# EAGLE design base (EAGLE 9.2.2)
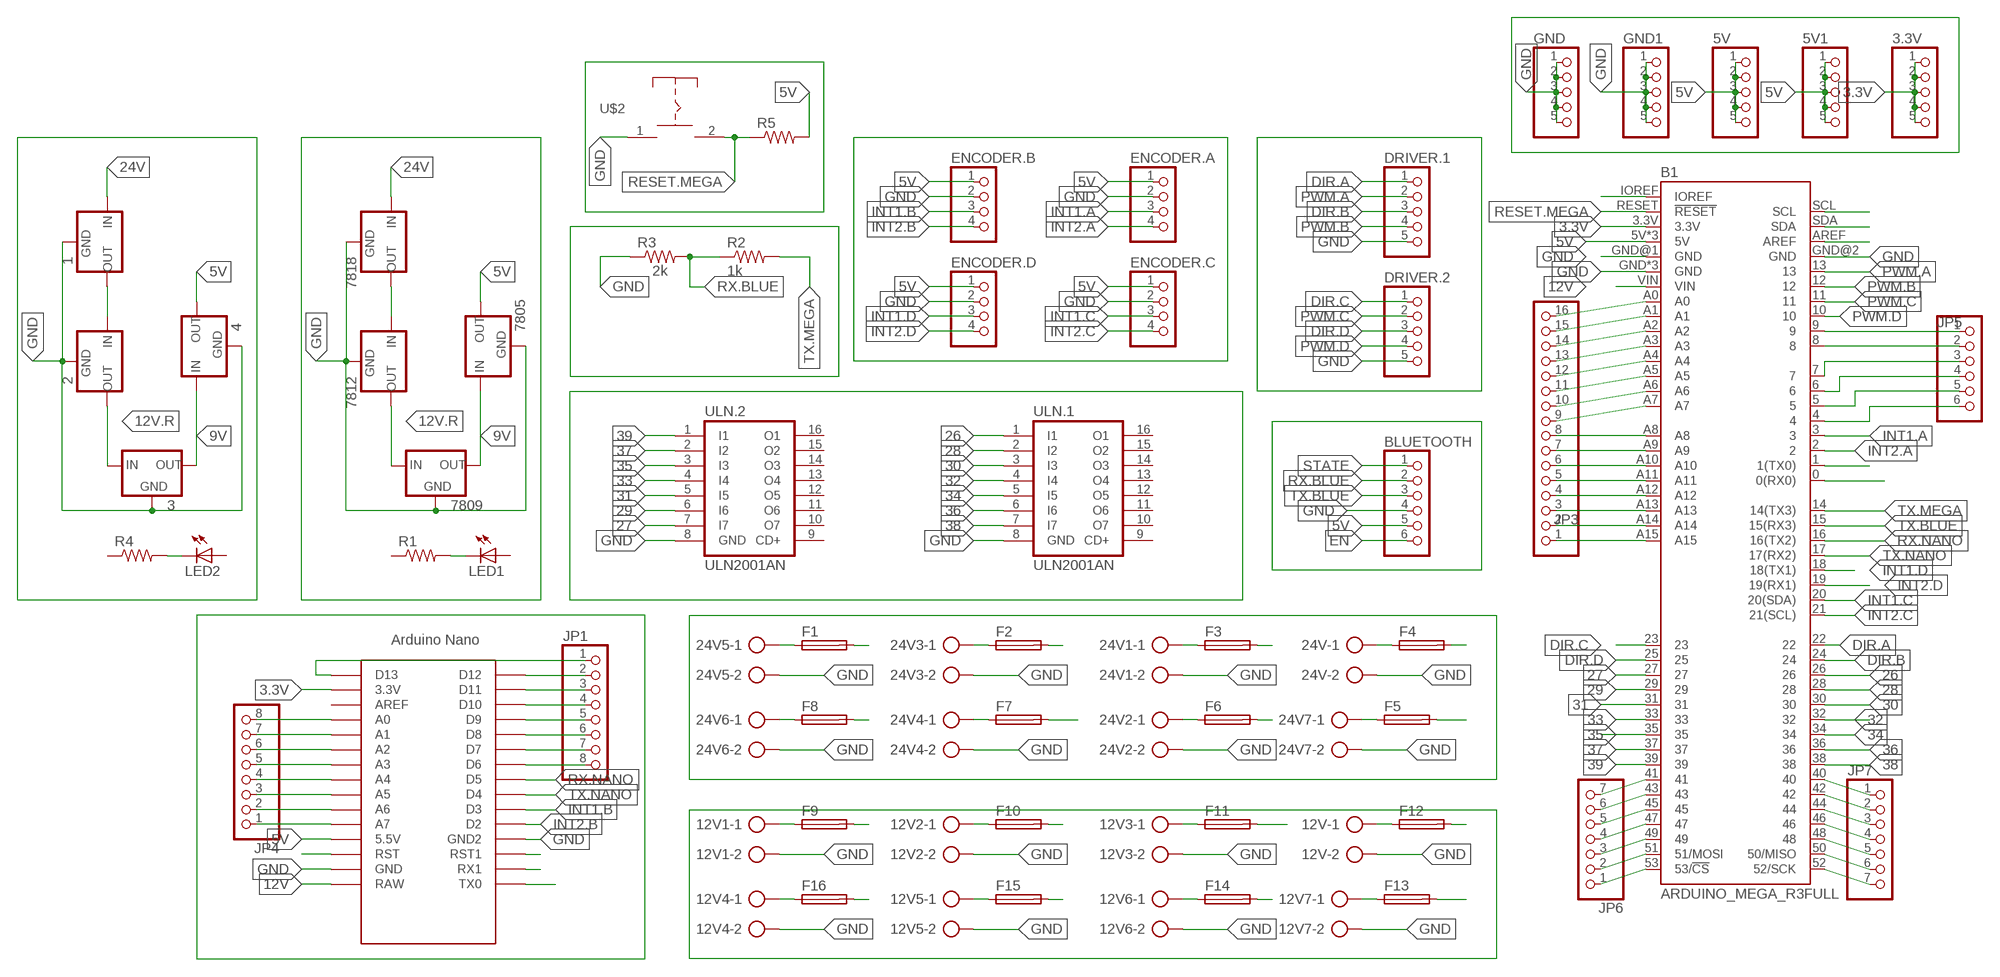
[diagram p0: schematic, sheet 1]

## Parts
1  78XXS  [78XXS]
2  78XXS  [78XXS]
3  78XXS  [78XXS]
3.3V  PINHD-1X5  [1X05]
4  78XXS  [78XXS]
5V  PINHD-1X5  [1X05]
5V1  PINHD-1X5  [1X05]
12V  AK300/2  [AK300/2]
12V1  AK300/2  [AK300/2]
12V2  AK300/2  [AK300/2]
12V3  AK300/2  [AK300/2]
12V4  AK300/2  [AK300/2]
12V5  AK300/2  [AK300/2]
12V6  AK300/2  [AK300/2]
12V7  AK300/2  [AK300/2]
24V  AK300/2  [AK300/2]
24V1  AK300/2  [AK300/2]
24V2  AK300/2  [AK300/2]
24V3  AK300/2  [AK300/2]
24V4  AK300/2  [AK300/2]
24V5  AK300/2  [AK300/2]
24V6  AK300/2  [AK300/2]
24V7  AK300/2  [AK300/2]
7805  78XXS  [78XXS]
7809  78XXS  [78XXS]
7812  78XXS  [78XXS]
7818  78XXS  [78XXS]
B1  ARDUINO_MEGA_R3FULL  [ARDUINO_MEGA_NO_SILK]
BLUETOOTH  PINHD-1X6  [1X06]
DRIVER.1  PINHD-1X5  [1X05]
DRIVER.2  PINHD-1X5  [1X05]
ENCODER.A  PINHD-1X4  [1X04]
ENCODER.B  PINHD-1X4  [1X04]
ENCODER.C  PINHD-1X4  [1X04]
ENCODER.D  PINHD-1X4  [1X04]
F1  GSH15  [GSH15]
F2  GSH15  [GSH15]
F3  GSH15  [GSH15]
F4  GSH15  [GSH15]
F5  GSH15  [GSH15]
F6  GSH15  [GSH15]
F7  GSH15  [GSH15]
F8  GSH15  [GSH15]
F9  GSH15  [GSH15]
F10  GSH15  [GSH15]
F11  GSH15  [GSH15]
F12  GSH15  [GSH15]
F13  GSH15  [GSH15]
F14  GSH15  [GSH15]
F15  GSH15  [GSH15]
F16  GSH15  [GSH15]
GND  PINHD-1X5  [1X05]
GND1  PINHD-1X5  [1X05]
JP1  PINHD-1X8  [1X08]
JP3  PINHD-1X16  [1X16]
JP4  PINHD-1X8  [1X08]
JP5  PINHD-1X6  [1X06]
JP6  PINHD-1X7  [1X07]
JP7  PINHD-1X7  [1X07]
LED1  LED5MM  [LED5MM]
LED2  LED5MM  [LED5MM]
R1  R-US_0204/7  [0204/7]
R2  1k  R-US_0204/7  [0204/7]
R3  2k  R-US_0207/10  [0207/10]
R4  R-US_0204/7  [0204/7]
R5  R-US_0204/7  [0204/7]
U$1  NANO  [NANO]
U$2  PUSHBOTTON  [PUSHBOTTON]
ULN.1  ULN2001AN  [DIL16]
ULN.2  ULN2001AN  [DIL16]

## Nets
3.3V: 3.3V.1 3.3V.2 3.3V.3 3.3V.4 3.3V.5 B1.3.3V U$1.3.3V
5V: 4.OUT 5V1.1 5V1.2 5V1.3 5V1.4 5V1.5 5V.1 5V.2 5V.3 5V.4 5V.5 7805.OUT B1.5V B1.5V@1(5V) B1.5V@2(5V) BLUETOOTH.5 ENCODER.A.1 ENCODER.B.1 ENCODER.C.1 ENCODER.D.1 R5.2 U$1.5V(5.5V)
9V: 3.OUT 4.IN 7805.IN 7809.OUT
12V: B1.VIN U$1.RAW
12V.R: 2.OUT 3.IN 7809.IN 7812.OUT
24V: 1.IN 7818.IN
26: B1.26 ULN.1.1(I1)
27: B1.27 ULN.2.7(I7)
28: B1.28 ULN.1.2(I2)
29: B1.29 ULN.2.6(I6)
30: B1.30 ULN.1.3(I3)
31: B1.31 ULN.2.5(I5)
32: B1.32 ULN.1.4(I4)
33: B1.33 ULN.2.4(I4)
34: B1.34 ULN.1.5(I5)
35: B1.35 ULN.2.3(I3)
36: B1.36 ULN.1.6(I6)
37: B1.37 ULN.2.2(I2)
38: B1.38 ULN.1.7(I7)
39: B1.39 ULN.2.1(I1)
40: B1.40 JP7.1
DIR.A: B1.22 DRIVER.1.1
DIR.B: B1.24 DRIVER.1.3
DIR.C: B1.23 DRIVER.2.1
DIR.D: B1.25 DRIVER.2.3
EN: BLUETOOTH.6
GND: 1.GND 2.GND 3.GND 4.GND 12V1.2 12V2.2 12V3.2 12V4.2 12V5.2 12V6.2 12V7.2 12V.2 24V1.2 24V2.2 24V3.2 24V4.2 24V5.2 24V6.2 24V7.2 24V.2 7805.GND 7809.GND 7812.GND 7818.GND B1.GND B1.GND@1(GND) B1.GND@2(GND) B1.GND@3(GND) B1.GND@4(GND) BLUETOOTH.4 DRIVER.1.5 DRIVER.2.5 ENCODER.A.2 ENCODER.B.2 ENCODER.C.2 ENCODER.D.2 GND1.1 GND1.2 GND1.3 GND1.4 GND1.5 GND.1 GND.2 GND.3 GND.4 GND.5 R3.1 U$1.GND U$1.GND1(GND2) U$2.1 ULN.1.8(GND) ULN.2.8(GND)
INT1.A: B1.3 ENCODER.A.3
INT1.B: ENCODER.B.3 U$1.D3
INT1.C: B1.20(20(SDA)) ENCODER.C.3
INT1.D: B1.18(18(TX1)) ENCODER.D.3
INT2.A: B1.2 ENCODER.A.4
INT2.B: ENCODER.B.4 U$1.D2
INT2.C: B1.21(21(SCL)) ENCODER.C.4
INT2.D: B1.19(19(RX1)) ENCODER.D.4
N$1: B1.SCL
N$2: B1.SDA
N$3: B1.AREF
N$6: 7812.IN 7818.OUT
N$8: LED2.K(C) R4.2
N$9: B1.9 JP5.1
N$10: B1.8 JP5.2
N$11: B1.7 JP5.3
N$12: B1.6 JP5.4
N$13: B1.5 JP5.5
N$14: B1.4 JP5.6
N$15: 1.OUT 2.IN
N$17: B1.1(1(TX0))
N$18: B1.0(0(RX0))
N$37: B1.42 JP7.2
N$38: B1.44 JP7.3
N$39: B1.46 JP7.4
N$40: B1.48 JP7.5
N$41: B1.50(50/MISO) JP7.6
N$42: B1.52(52/SCK) JP7.7
N$43: B1.IOREF
N$50: B1.A0 JP3.16
N$51: B1.A1 JP3.15
N$52: B1.A2 JP3.14
N$53: B1.A3 JP3.13
N$54: B1.A4 JP3.12
N$55: B1.A5 JP3.11
N$56: B1.A6 JP3.10
N$57: B1.A7 JP3.9
N$58: B1.A8 JP3.8
N$59: B1.A9 JP3.7
N$60: B1.A10 JP3.6
N$61: B1.A11 JP3.5
N$62: B1.A12 JP3.4
N$63: B1.A13 JP3.3
N$64: B1.A14 JP3.2
N$65: B1.A15 JP3.1
N$75: B1.41 JP6.7
N$76: B1.45 JP6.5
N$77: B1.43 JP6.6
N$78: B1.47 JP6.4
N$79: B1.49 JP6.3
N$80: B1.51(51/MOSI) JP6.2
N$81: B1.53(53/!CS) JP6.1
N$106: LED1.K(C) R1.2
N$107: JP1.1 U$1.D13
N$110: JP4.8 U$1.A0
N$111: JP4.7 U$1.A1
N$112: JP4.6 U$1.A2
N$113: JP4.5 U$1.A3
N$114: JP4.4 U$1.A4
N$115: JP4.3 U$1.A5
N$116: JP4.2 U$1.A6
N$117: JP4.1 U$1.A7
N$119: U$1.RST
N$122: JP1.2 U$1.D12
N$123: JP1.3 U$1.D11
N$124: JP1.4 U$1.D10
N$125: JP1.5 U$1.D9
N$126: JP1.6 U$1.D8
N$127: JP1.7 U$1.D7
N$128: JP1.8 U$1.D6
N$134: U$1.RST1
N$135: U$1.RX1
N$136: U$1.TX0
N$137: 12V7.1 F13.1
N$138: 24V5.1 F1.1
N$139: 24V6.1 F8.1
N$140: 24V3.1 F2.1
N$141: 24V4.1 F7.1
N$142: 24V1.1 F3.1
N$143: 24V.1 F4.1
N$144: 24V7.1 F5.1
N$145: 24V2.1 F6.1
N$146: 12V2.1 F10.1
N$147: 12V3.1 F11.1
N$148: 12V.1 F12.1
N$149: 12V6.1 F14.1
N$150: 12V5.1 F15.1
N$151: 12V4.1 F16.1
N$152: 12V1.1 F9.1
N$153: F1.2
N$154: F2.2
N$155: F3.2
N$156: F4.2
N$157: F5.2
N$158: F6.2
N$159: F7.2
N$160: F8.2
N$161: F9.2
N$162: F16.2
N$163: F15.2
N$164: F10.2
N$165: F11.2
N$166: F14.2
N$167: F13.2
N$168: F12.2
PWM.A: B1.13 DRIVER.1.2
PWM.B: B1.12 DRIVER.1.4
PWM.C: B1.11 DRIVER.2.2
PWM.D: B1.10 DRIVER.2.4
RESET.MEGA: B1.RESET(!RESET) R5.1 U$2.2
RX.BLUE: BLUETOOTH.2 R2.1 R3.2
RX.NANO: B1.16(16(TX2)) U$1.D5
STATE: BLUETOOTH.1
TX.BLUE: B1.15(15(RX3)) BLUETOOTH.3
TX.MEGA: B1.14(14(TX3)) R2.2
TX.NANO: B1.17(17(RX2)) U$1.D4
Unconnected: LED1.A LED2.A R1.1 R4.1 U$1.AREF ULN.1.9(CD+) ULN.1.10(O7) ULN.1.11(O6) ULN.1.12(O5) ULN.1.13(O4) ULN.1.14(O3) ULN.1.15(O2) ULN.1.16(O1) ULN.2.9(CD+) ULN.2.10(O7) ULN.2.11(O6) ULN.2.12(O5) ULN.2.13(O4) ULN.2.14(O3) ULN.2.15(O2) ULN.2.16(O1)

## Library data of the parts
1-4 7805 7809 7812 7818 = v-reg:78XXS: VOLTAGE REGULATOR
3.3V 5V 5V1 DRIVER.1 DRIVER.2 GND GND1 = pinhead:PINHD-1X5: PIN HEADER
12V 12V1-12V7 24V 24V1-24V7 = con-ptr500:AK300/2: CONNECTOR; OC_FARNELL: unknown; OC_NEWARK: unknown
B1 = SparkFun-Boards:ARDUINO_MEGA_R3: Arduino Mega R3 ATmega2560 R3 compatible footprint. SparkFun Products: Arduino Mega 2560 R3 <https://www.sparkfun.com/products/11061>
BLUETOOTH JP5 = pinhead:PINHD-1X6: PIN HEADER
ENCODER.A ENCODER.B ENCODER.C ENCODER.D = pinhead:PINHD-1X4: PIN HEADER
F1-F16 = fuse:GSH15: FUSE HOLDER grid 15mm, 19649 Wickmann; MPN: 64900001039; OC_FARNELL: 1271673; OC_NEWARK: 02P0318
JP1 JP4 = pinhead:PINHD-1X8: PIN HEADER
JP3 = pinhead:PINHD-1X16: PIN HEADER
JP6 JP7 = pinhead:PINHD-1X7: PIN HEADER
LED1 LED2 = led:LED: LED OSRAM: - CHIPLED LG R971, LG N971, LY N971, LG Q971, LY Q971, LO R971, LY R971 LH N974, LH R974 LS Q976, LO Q976, LY Q976 LO Q996 - Hyper CHIPLED LW Q18S LB Q993, LB Q99A, LB R99A - SideLED LS A670, LO A670, LY A670, LG A670, LP A670 LB A673, LV A673, LT A673, LW A673 LH A674 LY A675 LS A676, LA A676, LO A676, LY A676, LW A676 LS A679, LY A679, LG A679 - Hyper Micro SIDELED® LS Y876, LA Y876, LO Y876, LY Y876 LT Y87S - SmartLED LW L88C, LW L88S LB L89C, LB L89S, LG L890 LS L89K, LO L89K, LY L89K LS L896, LA L896, LO L896, LY L896 - TOPLED LS T670, LO T670, LY T670, LG T670, LP T670 LSG T670, LSP T670, LSY T670, LOP T670, LYG T670 LG T671, LOG T671, LSG T671 LB T673, LV T673, LT T673, LW T673 LH T674 LS T676, LA T676, LO T676, LY T676, LB T676, LH T676, LSB T676, LW T676 LB T67C, LV T67C, LT T67C, LS T67K, LO T67K, LY T67K, LW E67C LS E67B, LA E67B, LO E67B, LY E67B, LB E67C, LV E67C, LT E67C LW T67C LS T679, LY T679, LG T679 LS T770, LO T770, LY T770, LG T770, LP T770 LB T773, LV T773, LT T773, LW T773 LH T774 LS E675, LA E675, LY E675, LS T675 LS T776, LA T776, LO T776, LY T776, LB T776 LHGB T686 LT T68C, LB T68C - Hyper Mini TOPLED® LB M676 - Mini TOPLED Santana® LG M470 LS M47K, LO M47K, LY M47K Source: http://www.osram.convergy.de LUXEON: - LUMILED® LXK2-PW12-R00, LXK2-PW12-S00, LXK2-PW14-U00, LXK2-PW14-V00 LXK2-PM12-R00, LXK2-PM12-S00, LXK2-PM14-U00 LXK2-PE12-Q00, LXK2-PE12-R00, LXK2-PE12-S00, LXK2-PE14-T00, LXK2-PE14-U00 LXK2-PB12-K00, LXK2-PB12-L00, LXK2-PB12-M00, LXK2-PB14-N00, LXK2-PB14-P00, LXK2-PB14-Q00 LXK2-PR12-L00, LXK2-PR12-M00, LXK2-PR14-Q00, LXK2-PR14-R00 LXK2-PD12-Q00, LXK2-PD12-R00, LXK2-PD12-S00 LXK2-PH12-R00, LXK2-PH12-S00 LXK2-PL12-P00, LXK2-PL12-Q00, LXK2-PL12-R00 Source: www.luxeon.com KINGBRIGHT: KA-3528ASYC Source: www.kingbright.com
R1-R5 = rcl:R-US_: RESISTOR, American symbol; SPICEPREFIX: R
U$1 = Arduino-clone:NANO: Arduino Nano
U$2 = push botton:PUSHBOTTON
ULN.1 ULN.2 = uln-udn:ULN2001A: DRIVER ARRAY

## Board
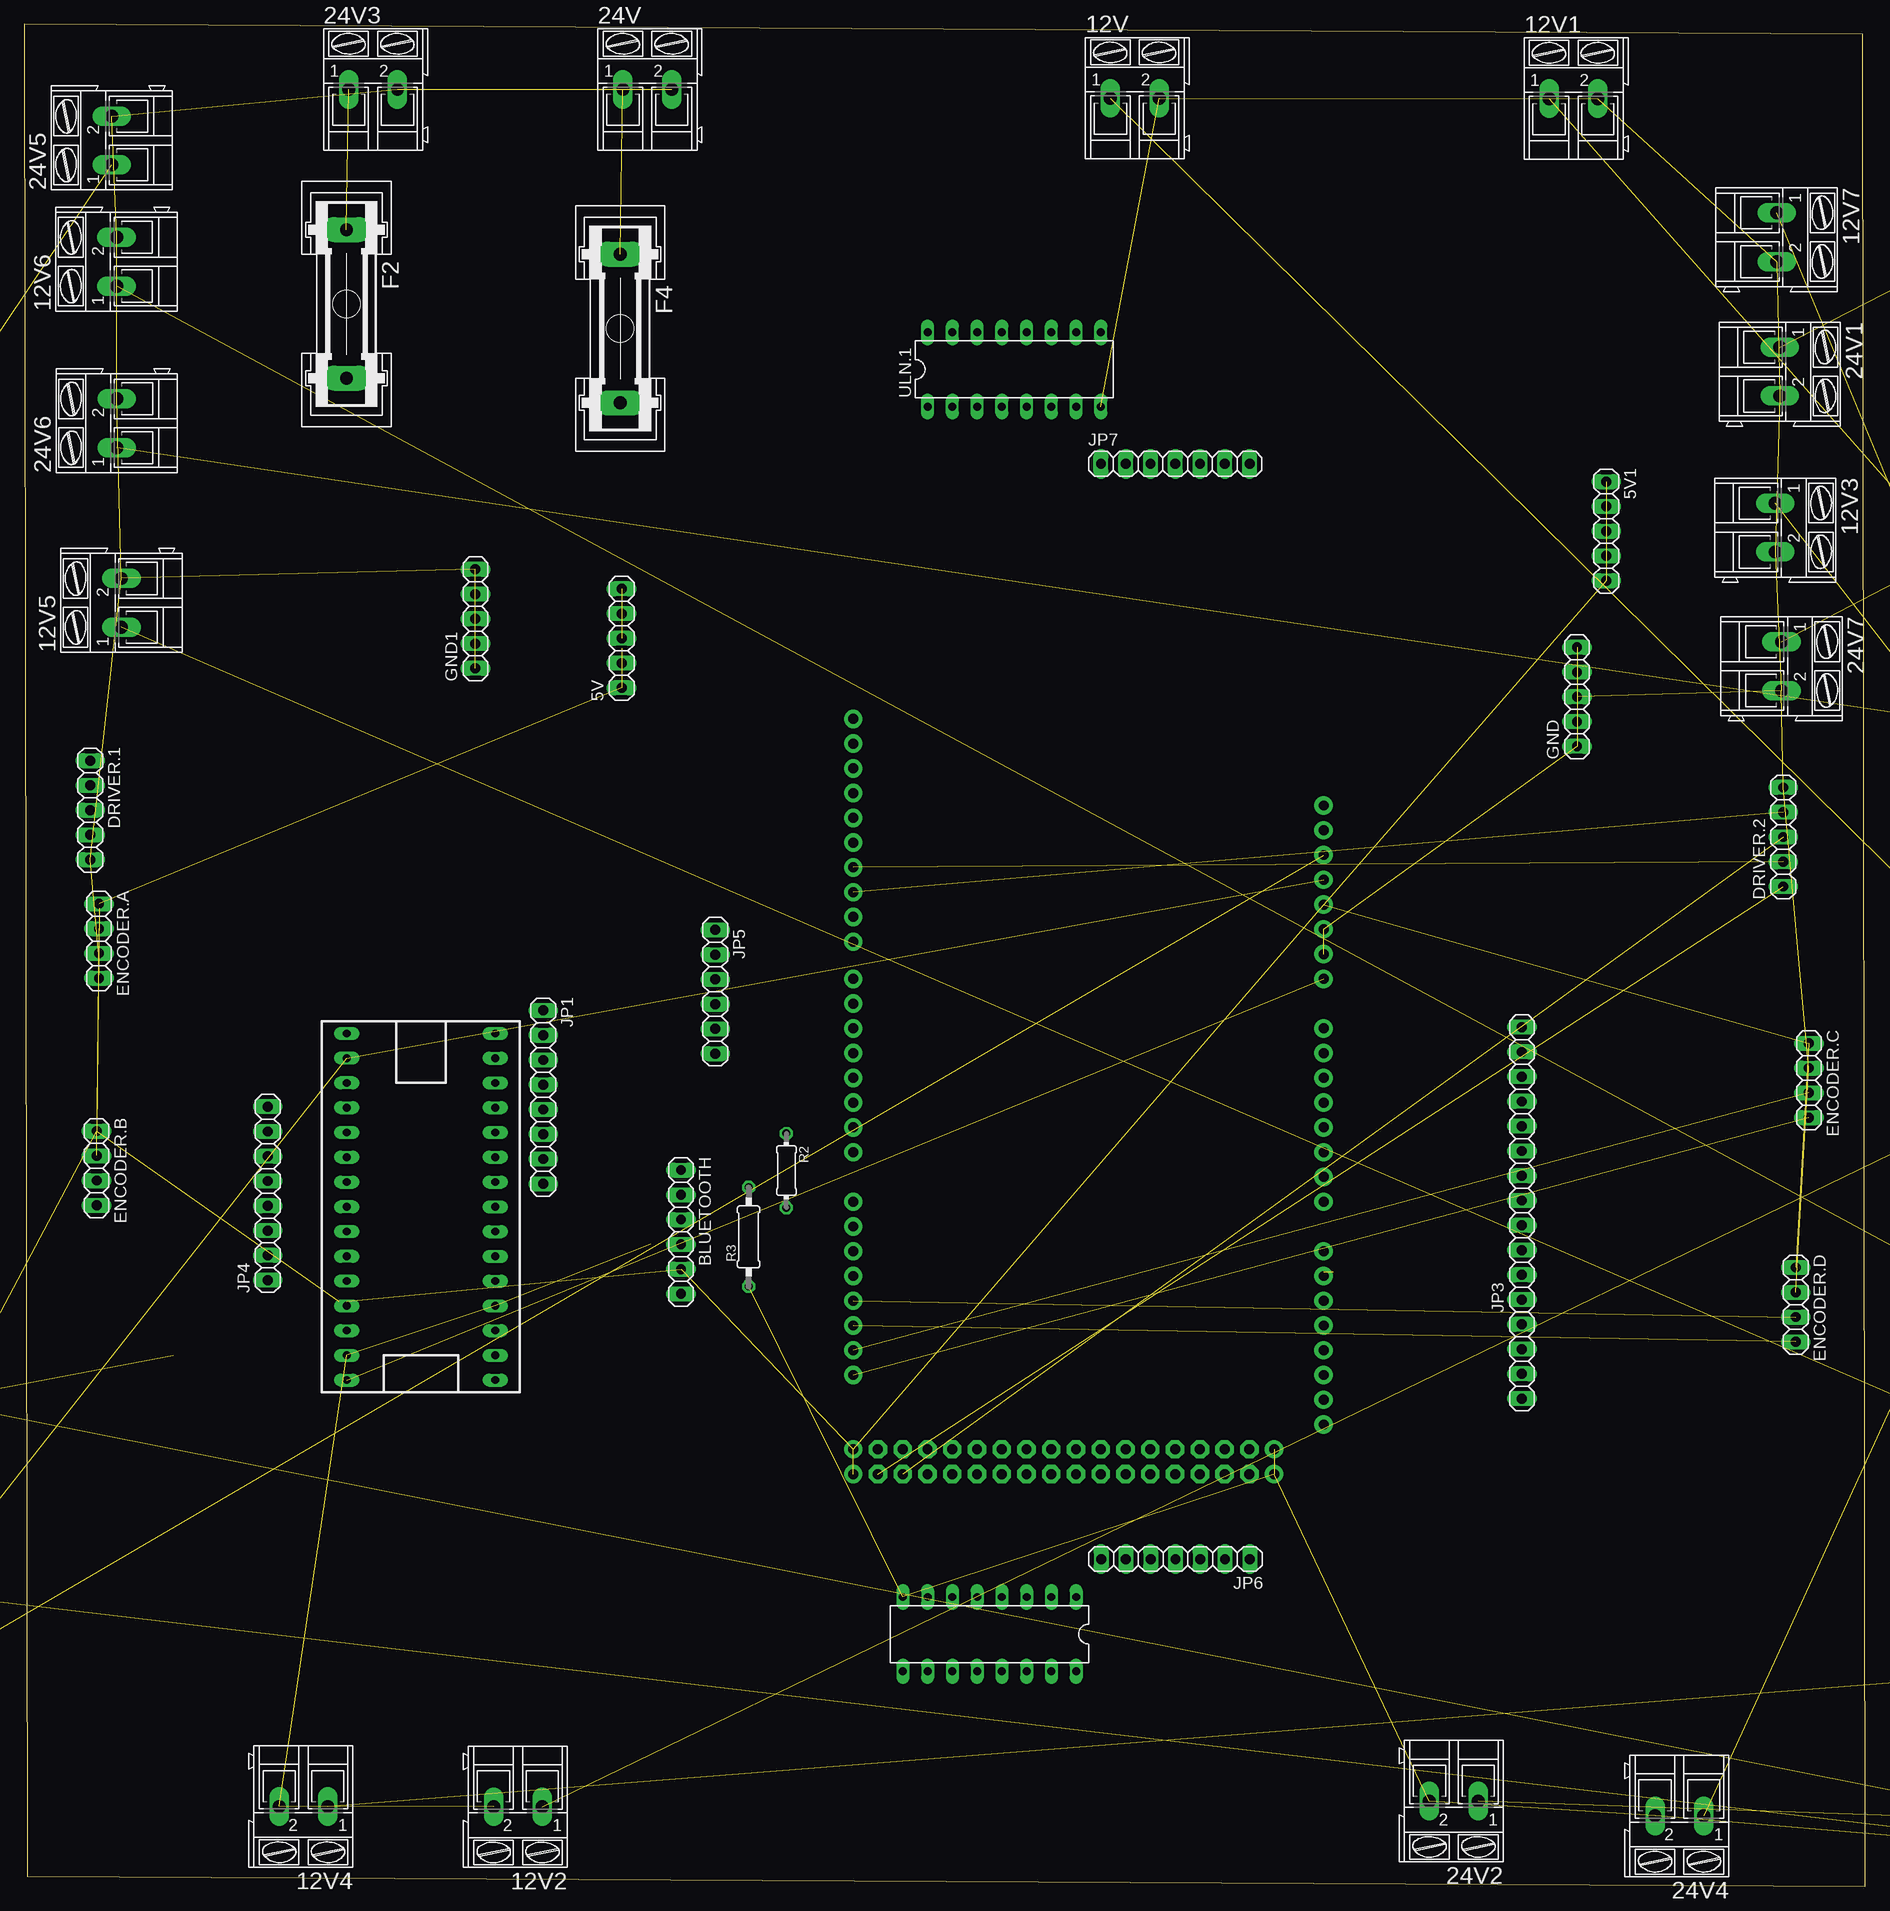
[diagram p1: board, top side]
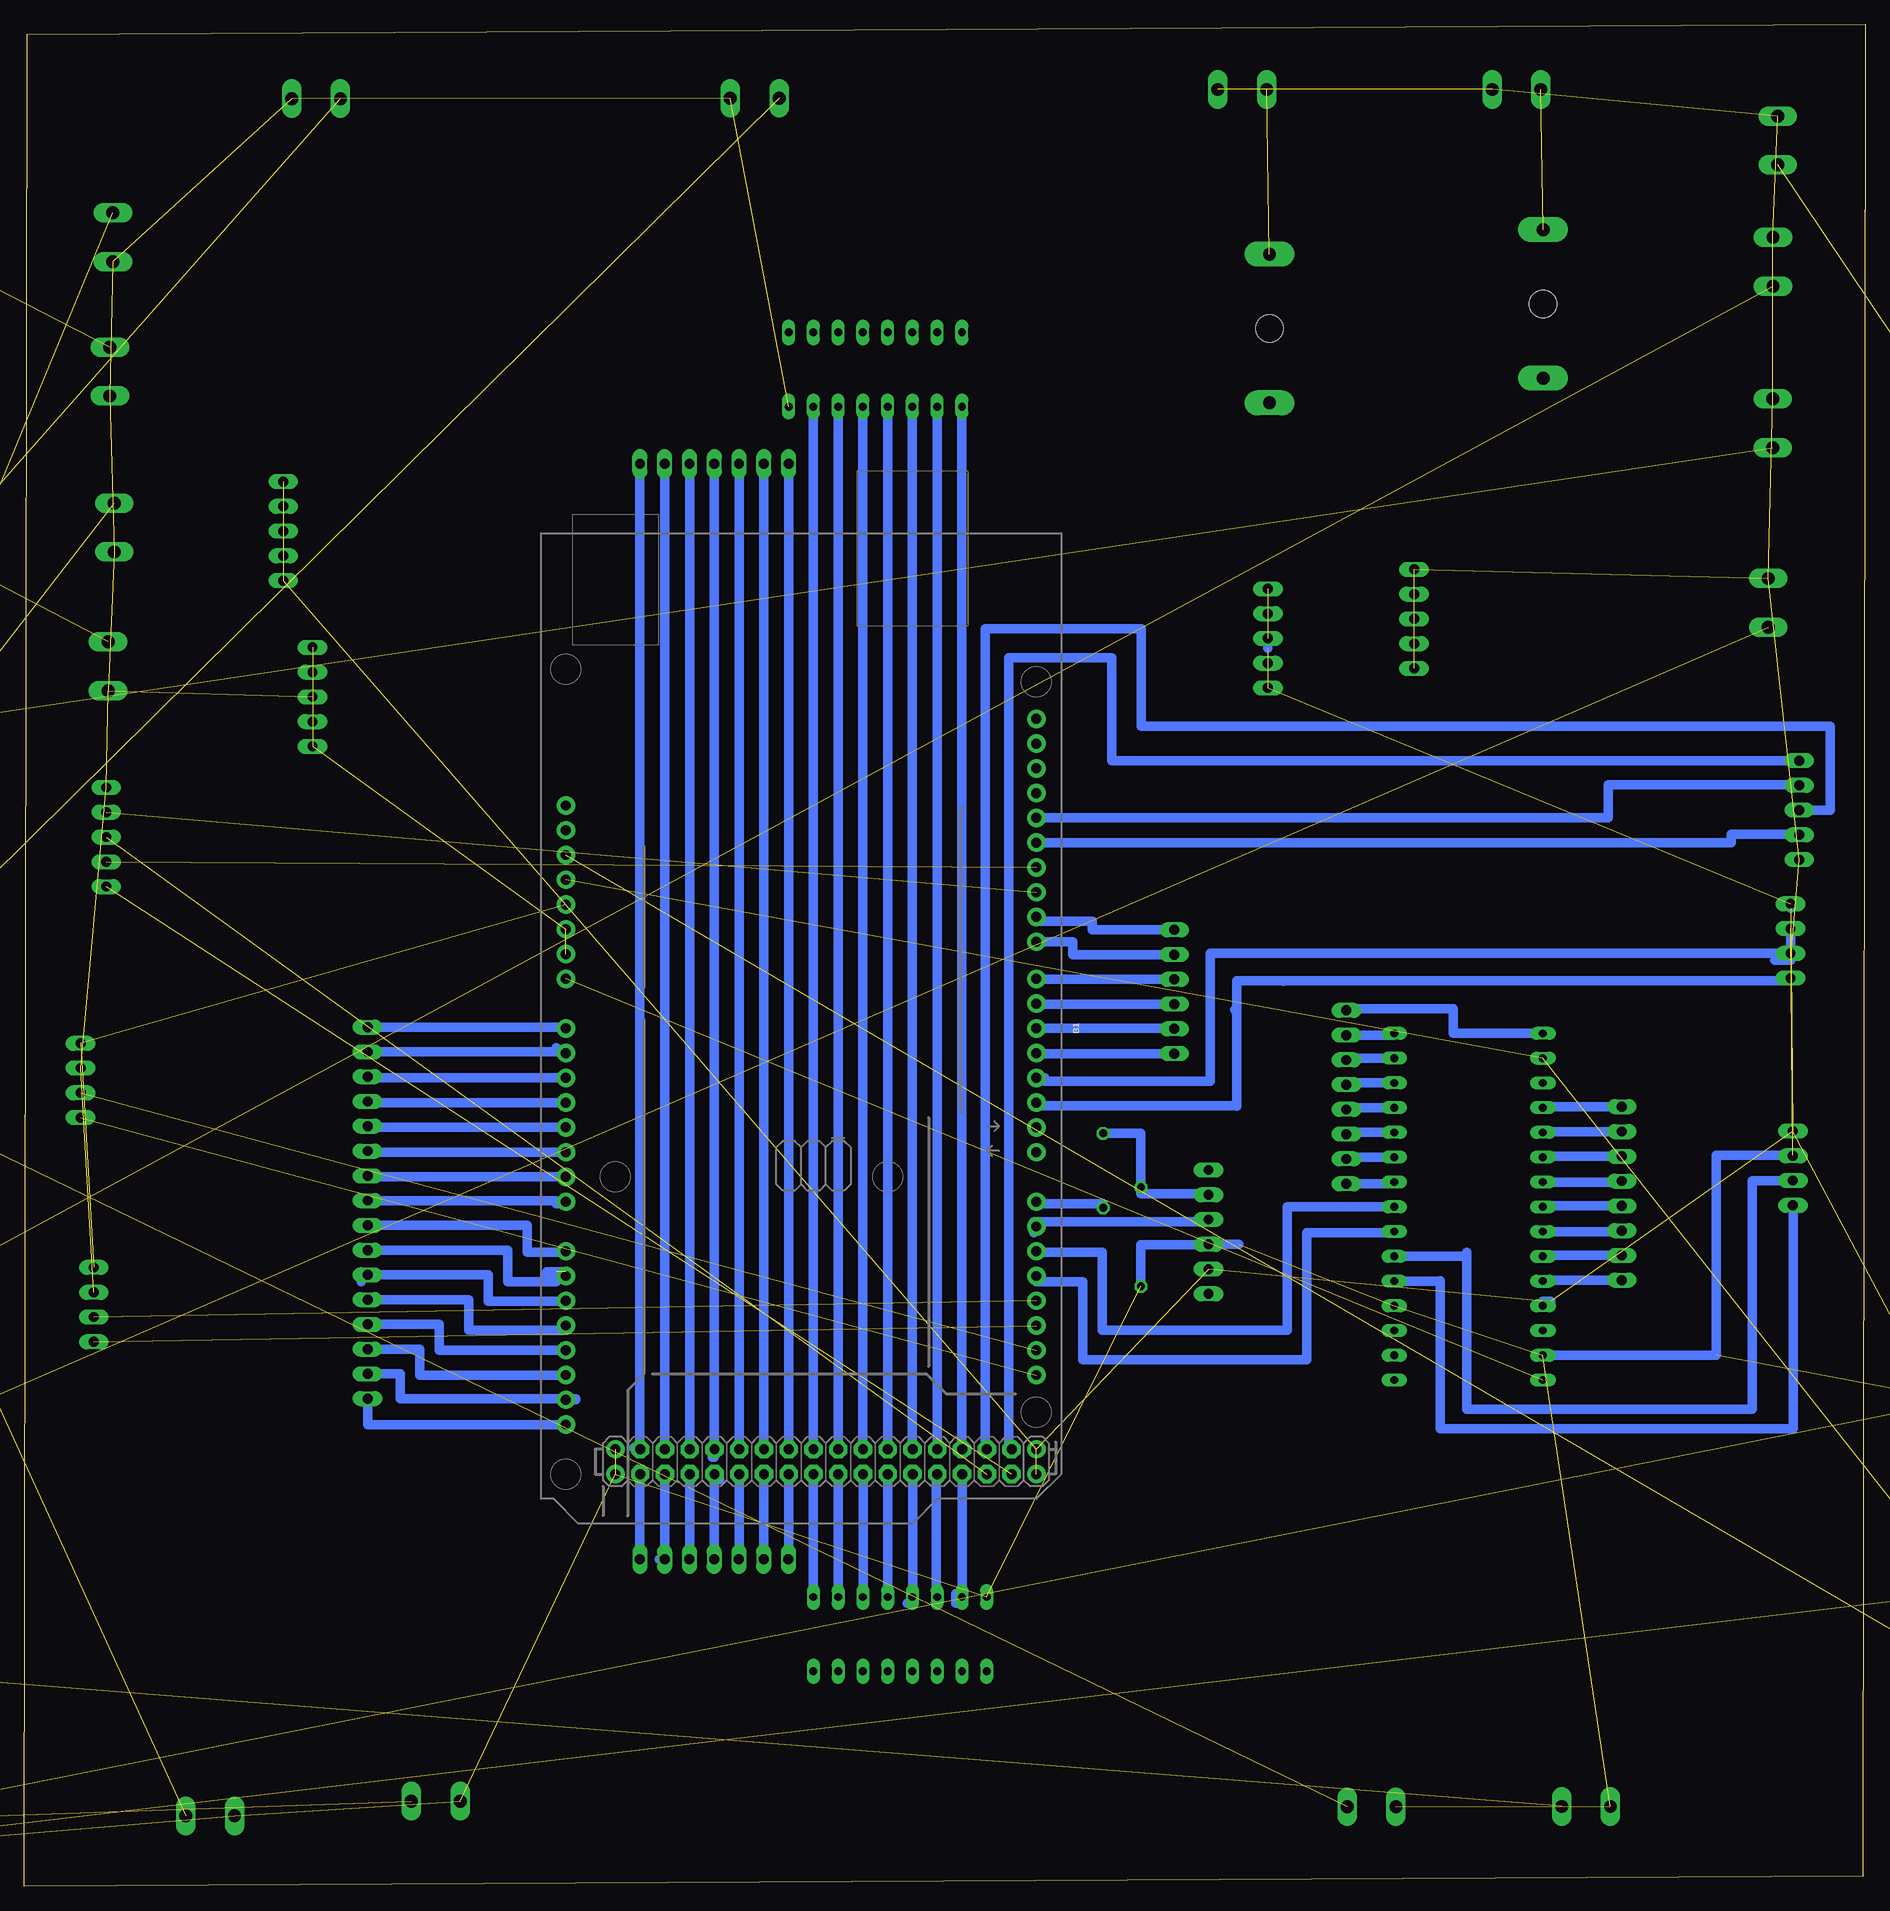
[diagram p2: board, bottom side, seen from below]

Size 188.83 x 190.98 mm. Coordinates in mm from the lower left corner, seen from the top.
Outline: 0.27,1 188.83,0 188.56,189.98 0,190.98 0.27,1
Copper layers (1*16): Top 0.035mm / dielectric 1.5mm / Bottom 0.035mm
Design rules "default": minimum track width 6mil, minimum drill 0.35mm, track to track 6mil, track to pad 6mil, pad to pad 6mil, via to via 6mil, smd to smd 6mil, copper to edge 40mil, drill to drill 6mil, minimum pad ring 10mil, minimum via ring 8mil, stop-mask expansion 4mil, vias tented up to drill 0mil, thermal gap 10mil

### Footprints (pad centres in the part's own frame; a part is rotated, then mirrored left to right if it is on the bottom)
78XXS = drill 1.016 long: GND 0,-2.54; IN -2.54,-2.54; OUT 2.54,-2.54
1X05 = drill 1.016 long: 1 -5.08,0; 2 -2.54,0; 3 0,0; 4 2.54,0; 5 5.08,0
AK300/2 = drill 1.321 long: 1 -2.515,0; 2 2.489,0
ARDUINO_MEGA_NO_SILK = drill 1.016 pad 1.88: 0 13.97,24.13; 1 11.43,24.13; 2 8.89,24.13; 3 6.35,24.13; 3.3V -13.97,-24.13; 4 3.81,24.13; 5 1.27,24.13; 5V -11.43,-24.13; 5V@1 44.45,24.13; 5V@2 46.99,24.13; 6 -1.27,24.13; 7 -3.81,24.13; 8 -7.62,24.13; 9 -10.16,24.13; 10 -12.7,24.13; 11 -15.24,24.13; 12 -17.78,24.13; 13 -20.32,24.13; 14 19.05,24.13; 15 21.59,24.13; 16 24.13,24.13; 17 26.67,24.13; 18 29.21,24.13; 19 31.75,24.13; 20 34.29,24.13; 21 36.83,24.13; A0 1.27,-24.13; A1 3.81,-24.13; A2 6.35,-24.13; A3 8.89,-24.13; A4 11.43,-24.13; A5 13.97,-24.13; A6 16.51,-24.13; A7 19.05,-24.13; A8 24.13,-24.13; A9 26.67,-24.13; A10 29.21,-24.13; A11 31.75,-24.13; A12 34.29,-24.13; A13 36.83,-24.13; A14 39.37,-24.13; A15 41.91,-24.13; AREF -25.4,24.13; GND -8.89,-24.13; GND@1 -6.35,-24.13; GND@2 44.45,-19.05; GND@3 46.99,-19.05; GND@4 -22.86,24.13; IOREF -19.05,-24.13; NC -21.59,-24.13; RESET -16.51,-24.13; SCL -30.48,24.13; SDA -27.94,24.13; VIN -3.81,-24.13 | drill 1.016 pad 1.88 octagon: 22 44.45,21.59; 23 46.99,21.59; 24 44.45,19.05; 25 46.99,19.05; 26 44.45,16.51; 27 46.99,16.51; 28 44.45,13.97; 29 46.99,13.97; 30 44.45,11.43; 31 46.99,11.43; 32 44.45,8.89; 33 46.99,8.89; 34 44.45,6.35; 35 46.99,6.35; 36 44.45,3.81; 37 46.99,3.81; 38 44.45,1.27; 39 46.99,1.27; 40 44.45,-1.27; 41 46.99,-1.27; 42 44.45,-3.81; 43 46.99,-3.81; 44 44.45,-6.35; 45 46.99,-6.35; 46 44.45,-8.89; 47 46.99,-8.89; 48 44.45,-11.43; 49 46.99,-11.43; 50 44.45,-13.97; 51 46.99,-13.97; 52 44.45,-16.51; 53 46.99,-16.51
1X06 = drill 1.016 long: 1 -6.35,0; 2 -3.81,0; 3 -1.27,0; 4 1.27,0; 5 3.81,0; 6 6.35,0
1X04 = drill 1.016 long: 1 -3.81,0; 2 -1.27,0; 3 1.27,0; 4 3.81,0
GSH15 = drill 1.321 pad 2.54 long: 1 -7.62,0; 2 7.62,0 | hole 2.794: 0,0
1X08 = drill 1.016 long: 1 -8.89,0; 2 -6.35,0; 3 -3.81,0; 4 -1.27,0; 5 1.27,0; 6 3.81,0; 7 6.35,0; 8 8.89,0
1X16 = drill 1.016 long: 1 -19.05,0; 2 -16.51,0; 3 -13.97,0; 4 -11.43,0; 5 -8.89,0; 6 -6.35,0; 7 -3.81,0; 8 -1.27,0; 9 1.27,0; 10 3.81,0; 11 6.35,0; 12 8.89,0; 13 11.43,0; 14 13.97,0; 15 16.51,0; 16 19.05,0
1X07 = drill 1.016 long: 1 -7.62,0; 2 -5.08,0; 3 -2.54,0; 4 0,0; 5 2.54,0; 6 5.08,0; 7 7.62,0
LED5MM = drill 0.813 octagon: A -1.27,0; K 1.27,0
0204/7 = drill 0.813 octagon: 1 -3.81,0; 2 3.81,0
0207/10 = drill 0.813 octagon: 1 -5.08,0; 2 5.08,0
NANO = drill 0.8 long: 3.3V -10.16,24.13; 5V -10.16,-1.27; A0 -10.16,19.05; A1 -10.16,16.51; A2 -10.16,13.97; A3 -10.16,11.43; A4 -10.16,8.89; A5 -10.16,6.35; A6 -10.16,3.81; A7 -10.16,1.27; AREF -10.16,21.59; D2 5.08,1.27; D3 5.08,3.81; D4 5.08,6.35; D5 5.08,8.89; D6 5.08,11.43; D7 5.08,13.97; D8 5.08,16.51; D9 5.08,19.05; D10 5.08,21.59; D11 5.08,24.13; D12 5.08,26.67; D13 -10.16,26.67; GND -10.16,-6.35; GND1 5.08,-1.27; RAW -10.16,-8.89; RST -10.16,-3.81; RST1 5.08,-3.81; RX1 5.08,-6.35; TX0 5.08,-8.89
PUSHBOTTON = drill 0.6 long: 1 -12.43,5.08; 2 -7.62,5.08
DIL16 = drill 0.813 long: 1 -8.89,-3.81; 2 -6.35,-3.81; 3 -3.81,-3.81; 4 -1.27,-3.81; 5 1.27,-3.81; 6 3.81,-3.81; 7 6.35,-3.81; 8 8.89,-3.81; 9 8.89,3.81; 10 6.35,3.81; 11 3.81,3.81; 12 1.27,3.81; 13 -1.27,3.81; 14 -3.81,3.81; 15 -6.35,3.81; 16 -8.89,3.81

### Placement (x,y rotation side)
1  -45.86,37.15 0 top  (outside the outline)
2  -18.86,50.53 0 top  (outside the outline)
3  -18.86,42.91 0 top  (outside the outline)
3.3V  -43.73,-6 0 top  (outside the outline)
4  -18.86,35.29 0 top  (outside the outline)
5V  61.27,128 90 top
5V1  162.27,139 270 top
12V  113.92,183.41 0 top
12V1  158.92,183.36 0 top
12V2  50.62,8.15 180 top
12V3  179.61,139.35 270 top
12V4  28.62,8.17 180 top
12V5  9.95,131.65 90 top
12V6  9.46,166.65 90 top
12V7  179.75,169.13 270 top
24V  63.92,184.3 0 top
24V1  180.06,155.35 270 top
24V2  146.62,8.72 180 top
24V3  35.78,184.3 0 top
24V4  169.76,7.21 180 top
24V5  8.97,179.08 90 top
24V6  9.48,150.08 90 top
24V7  180.24,125.13 270 top
7805  -45.86,44.77 0 top  (outside the outline)
7809  -45.86,52.39 0 top  (outside the outline)
7812  -45.86,60.01 0 top  (outside the outline)
7818  228.14,4.63 0 top  (outside the outline)
B1  109.15,89.26 270 bottom
BLUETOOTH  67.36,67.11 270 top
DRIVER.1  6.76,110.38 270 top
DRIVER.2  180.43,107.62 90 top
ENCODER.A  7.66,96.95 270 top
ENCODER.B  7.41,73.65 270 top
ENCODER.C  183.06,82.65 270 top
ENCODER.D  181.71,59.65 270 top
F1  -36.03,98.2 0 top  (outside the outline)
F2  33.04,162.3 270 top
F3  221.49,175.27 0 top  (outside the outline)
F4  61.11,159.78 270 top
F5  231.49,150.41 0 top  (outside the outline)
F6  267.29,12.22 90 top  (outside the outline)
F7  234.49,126.55 0 top  (outside the outline)
F8  234.49,115.12 0 top  (outside the outline)
F9  234.49,103.69 0 top  (outside the outline)
F10  234.49,92.26 0 top  (outside the outline)
F11  234.49,80.83 0 top  (outside the outline)
F12  234.49,69.4 0 top  (outside the outline)
F13  234.49,57.97 0 top  (outside the outline)
F14  234.49,46.54 0 top  (outside the outline)
F15  234.49,35.11 0 top  (outside the outline)
F16  234.49,23.68 0 top  (outside the outline)
GND  159.27,122 90 top
GND1  46.27,130 90 top
JP1  53.22,80.94 270 top
JP3  153.62,69.06 90 top
JP4  24.97,71.06 90 top
JP5  70.87,91.75 270 top
JP6  118.08,33.55 180 top
JP7  118.06,145.9 0 top
LED1  -45.35,20.26 0 top  (outside the outline)
LED2  -21.4,25.13 0 top  (outside the outline)
R1  -44.08,13.91 0 top  (outside the outline)
R2  78.17,73.4 270 top
R3  74.29,66.6 90 top
R4  -20.13,18.78 0 top  (outside the outline)
R5  -22.13,12.7 0 top  (outside the outline)
U$1  43.22,60.8 0 top
U$2  -22.13,11.43 0 top  (outside the outline)
ULN.1  101.54,155.58 0 top
ULN.2  99,25.85 180 top

### Tracks (layer width: path | path; a pad name or v marks a point on that pad's centre or on a via)
3.3V  (6 unrouted)
5V  (21 unrouted)
  Bottom 1: 32.27,59.4 32.27,60 33.06,60 U$1.5V | 7.66,100.3 ENCODER.A.1 | 67.36,63.28 BLUETOOTH.5 | 5V.3 61.27,127
9V  (3 unrouted)
12V  (1 unrouted)
12V.R  (3 unrouted)
24V  (1 unrouted)
26
  Bottom 1: ULN.1.1 B1.26
27
  Bottom 1: B1.27 92.64,29 93.27,29 93.27,30 92.65,30 ULN.2.7
28
  Bottom 1: ULN.1.2 B1.28
29
  Bottom 1: B1.29 95.27,42.27 95.27,29.66 | 95.27,29 95.27,29.66 | 95.27,29.66 ULN.2.6
30
  Bottom 1: ULN.1.3 B1.30
31
  Bottom 1: B1.31 97.72,29 97.73,29 | 98.27,29 97.73,29 | 97.73,29 ULN.2.5
32
  Bottom 1: ULN.1.4 B1.32
33
  Bottom 1: B1.33 ULN.2.4
34
  Bottom 1: ULN.1.5 B1.34
35
  Bottom 1: B1.35 ULN.2.3
36
  Bottom 1: ULN.1.6 B1.36
37
  Bottom 1: B1.37 ULN.2.2
38
  Bottom 1: ULN.1.7 B1.38
39
  Bottom 1: ULN.2.1 107.89,42 108.27,42 108.27,42.27 B1.39
40
  Bottom 1: JP7.1 110.44,44.81 B1.40
DIR.A
  Bottom 1: DRIVER.1.1 77.27,115.46 77.27,126 87.86,126 87.86,45.11 B1.22
DIR.B
  Bottom 1: DRIVER.1.3 3.57,110.38 3.57,119 74.27,119 74.27,129 90.27,129 90.27,45 90.1,45 B1.24
DIR.C  (1 unrouted)
DIR.D  (1 unrouted)
GND  (47 unrouted)
  Bottom 1: R3.1 74.29,65.82 67.36,65.82 BLUETOOTH.4 64.27,65.84 | U$1.GND 15.27,54.45 15.27,75 7.41,75 ENCODER.B.2 | 9.27,95 7.66,95 ENCODER.A.2
INT1.A
  Bottom 1: ENCODER.A.3 67.17,95.68 67.17,82.56 84.17,82.56 84.17,82.91 B1.3
INT1.B
  Bottom 1: ENCODER.B.3 11.57,72.38 11.57,48.9 40.87,48.9 40.87,64.3 40.87,64.61 | 40.87,64.61 40.87,65 | U$1.D3 40.87,64.61
INT1.C  (1 unrouted)
INT1.D  (1 unrouted)
INT2.A
  Bottom 1: B1.2 84.72,80.07 64.47,80.07 | 64.47,80.07 64.47,80 | 64.47,80.07 64.47,89.9 | 64.47,89.9 64.47,92.9 59.57,92.9 | 64.47,89.9 64.67,89.9 | 59.57,92.9 59.57,92.85 59.67,92.85 | 59.57,92.9 7.9,92.9 ENCODER.A.4
INT2.B
  Bottom 1: U$1.D2 43.57,62.07 | 43.57,62.07 43.57,62.1 | 43.57,62.07 43.57,46.9 7.37,46.9 7.37,69.9 6.67,69.9 6.67,69.84 ENCODER.B.4
INT2.C  (1 unrouted)
INT2.D  (1 unrouted)
N$6  (1 unrouted)
N$8  (1 unrouted)
N$9
  Bottom 1: JP5.1 79.27,98.1 79.27,99 85.27,99 85.27,99.42 B1.9
N$10
  Bottom 1: B1.8 81.27,96.88 81.27,95.56 JP5.2
N$11
  Bottom 1: JP5.3 85.02,93.02 B1.7
N$12
  Bottom 1: JP5.4 85.02,90.48 B1.6
N$13
  Bottom 1: B1.5 71.27,87.99 | 71.27,87.99 71.27,88 | JP5.5 70.87,87.99 71.27,87.99
N$14
  Bottom 1: JP5.6 85.02,85.4 B1.4
N$15  (1 unrouted)
N$37
  Bottom 1: JP7.2 112.98,44.81 B1.42
N$38
  Bottom 1: JP7.3 115.5,145.9 B1.44
N$39
  Bottom 1: JP7.4 118.06,44 | 118.06,44 118.27,44 | 118.06,44 118.04,44 B1.46
N$40
  Bottom 1: JP7.5 120.6,44.81 B1.48
N$41
  Bottom 1: JP7.6 123.14,44.81 B1.50
N$42
  Bottom 1: JP7.7 125.68,45 126.27,45 126.27,44.81 B1.52
N$50
  Bottom 1: B1.A0 133.28,88.11 JP3.16
N$51
  Bottom 1: JP3.15 134.27,85.57 | 134.27,85.57 134.27,86 | B1.A1 133.28,85.57 134.27,85.57
N$52
  Bottom 1: B1.A2 153.62,82.91 JP3.14
N$53
  Bottom 1: B1.A3 153.62,80.37 JP3.13
N$54
  Bottom 1: B1.A4 151.27,77.83 153.62,77.83 | 153.62,77.83 154.27,77.83 154.27,78 | JP3.12 153.62,77.83
N$55
  Bottom 1: JP3.11 153.62,75.29 B1.A5
N$56
  Bottom 1: B1.A6 153.62,72.75 JP3.10
N$57
  Bottom 1: JP3.9 134.27,70.33 134.27,70 133.28,70 B1.A7
N$58
  Bottom 1: B1.A8 133.28,65 137.27,65 137.27,67.79 JP3.8
N$59  (1 unrouted)
  Bottom 1: JP3.7 139.27,65.25 139.27,62 134.27,62 134.27,63 | B1.A9 133.28,63 135.27,63 135.27,62.59 B1.A9
N$60
  Bottom 1: 154.27,63 154.27,62.71 | 154.27,62 154.27,62.71 | 154.27,62.71 JP3.6 141.27,62.71 141.27,60 133.28,60 B1.A10
N$61
  Bottom 1: B1.A11 133.28,57 143.27,57 143.27,60.17 JP3.5
N$62
  Bottom 1: JP3.4 146.27,57.63 146.27,54.97 B1.A12
N$63
  Bottom 1: B1.A13 148.27,52.43 148.27,55.09 JP3.3
N$64
  Bottom 1: JP3.2 150.27,52.55 150.27,50 132.27,50 132.27,49.89 B1.A14
N$65
  Bottom 1: B1.A15 153.62,47.35 JP3.1
N$75
  Bottom 1: B1.41 110.42,33.55 JP6.7
N$76
  Bottom 1: B1.45 115.5,33.55 JP6.5
N$77
  Bottom 1: B1.43 112.96,33.55 JP6.6
N$78
  Bottom 1: 117.48,41.71 B1.47 118.08,42.27 JP6.4
N$79
  Bottom 1: 120.87,33.8 JP6.3 120.58,33.55 B1.49 120.27,42.27
N$80
  Bottom 1: 123.72,33.55 JP6.2 123.12,33.55 B1.51
N$81
  Bottom 1: B1.53 125.7,42.23 JP6.1
N$106  (1 unrouted)
N$107
  Bottom 1: U$1.D13 42.27,87.47 42.27,90 53.05,90 JP1.1
N$110
  Bottom 1: JP4.8 33.06,79.95 U$1.A0
N$111
  Bottom 1: JP4.7 33.06,77.41 U$1.A1
N$112
  Bottom 1: JP4.6 33.06,74.87 U$1.A2
N$113
  Bottom 1: U$1.A3 24.97,72.23 JP4.5
N$114
  Bottom 1: JP4.4 33.06,69.79 U$1.A4
N$115
  Bottom 1: U$1.A5 24.97,67.15 JP4.3
N$116
  Bottom 1: JP4.2 33.06,64.71 U$1.A6
N$117
  Bottom 1: JP4.1 33.06,62.17 U$1.A7
N$122
  Bottom 1: U$1.D12 48.3,87.29 JP1.2
N$123
  Bottom 1: U$1.D11 53.22,84.93 JP1.3
N$124
  Bottom 1: U$1.D10 53.22,82.39 JP1.4
N$125
  Bottom 1: U$1.D9 53.22,79.85 JP1.5
N$126
  Bottom 1: U$1.D8 53.22,77.31 JP1.6
N$127
  Bottom 1: JP1.7 53.22,74.77 U$1.D7
N$128
  Bottom 1: U$1.D6 48.3,72.05 JP1.8
N$137  (1 unrouted)
N$138  (1 unrouted)
N$139  (1 unrouted)
N$140  (1 unrouted)
N$141  (1 unrouted)
N$142  (1 unrouted)
N$143  (1 unrouted)
N$144  (1 unrouted)
N$145  (1 unrouted)
N$146  (1 unrouted)
N$147  (1 unrouted)
N$148  (1 unrouted)
N$149  (1 unrouted)
N$150  (1 unrouted)
N$151  (1 unrouted)
N$152  (1 unrouted)
PWM.A
  Bottom 1: DRIVER.1.2 6.84,113 26.37,113 26.37,109.58 B1.13
PWM.B
  Bottom 1: DRIVER.1.4 6.82,107.9 13.76,107.9 13.76,107.04 B1.12
PWM.C  (1 unrouted)
PWM.D  (1 unrouted)
RESET.MEGA  (2 unrouted)
RX.BLUE
  Bottom 1: R2.1 74.29,77.21 R3.2 74.29,71 67.36,71 BLUETOOTH.2
RX.NANO
  Bottom 1: U$1.D5 59.27,69.69 59.27,57 78.27,57 78.27,65 85.27,65 85.27,65.13 B1.16
TX.BLUE
  Bottom 1: 85.27,67.67 85.27,68.18 67.56,68.18 BLUETOOTH.3 | 85.27,67 85.27,67.67 | 85.27,67.67 B1.15
TX.MEGA
  Bottom 1: B1.14 85.02,70 78.17,70 R2.2
TX.NANO
  Bottom 1: B1.17 85.02,62 80.27,62 80.27,54 57.27,54 57.27,67.02 48.27,67.02 48.27,67.15 U$1.D4